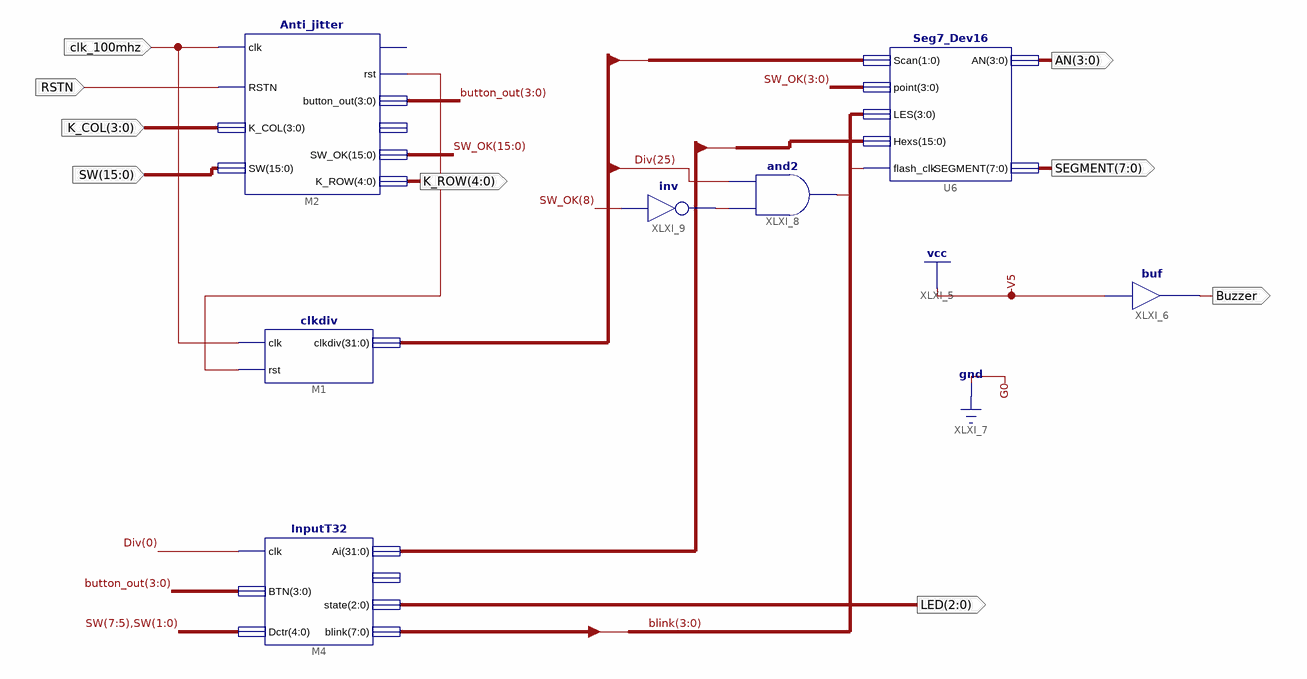
[diagram p0: schematic sheet 1]
// Xilinx ISE schematic I2Disp.sch (kintex7) as structural Verilog: 7 symbols, 9 ports
module I2Disp (
  input  RSTN,
  input  clk_100mhz,
  input  [3:0] K_COL,
  input  [15:0] SW,
  output [4:0] K_ROW,
  output [7:0] SEGMENT,
  output [3:0] AN,
  output Buzzer,
  output [2:0] LED
);

  wire XLXN_6, XLXN_7, XLXN_10;
  wire [3:0] button_out;
  wire [7:0] blink;
  wire [15:0] SW_OK;
  wire [31:0] Ai, Div;

  Anti_jitter M2 (
    .clk(clk_100mhz), .RSTN(RSTN), .K_COL(K_COL), .SW(SW), .rst(XLXN_6), .button_out(button_out),
    .SW_OK(SW_OK), .K_ROW(K_ROW));  // open: CR, button_pulse
  clkdiv M1 (.clk(clk_100mhz), .rst(XLXN_6), .clkdiv(Div));
  InputT32 M4 (
    .clk(Div[0]), .BTN(button_out), .Dctr({SW[7:5], SW[1:0]}), .Ai(Ai), .state(LED), .blink(blink));  // open: Bi
  Seg7_Dev16 U6 (
    .Scan(Div[18:17]), .point(SW_OK[3:0]), .LES(blink[3:0]), .Hexs(Ai[15:0]), .flash_clk(XLXN_7), .AN(AN),
    .SEGMENT(SEGMENT));
  buf XLXI_6 (Buzzer, 1'b1);
  and XLXI_8 (XLXN_7, XLXN_10, Div[25]);
  not XLXI_9 (XLXN_10, SW_OK[8]);
endmodule
